# Altium schematic sheet 17_FLOW_Sensor.SchDoc
size 420 x 297 mm; SheetNumber: 27; SheetTotal: 36
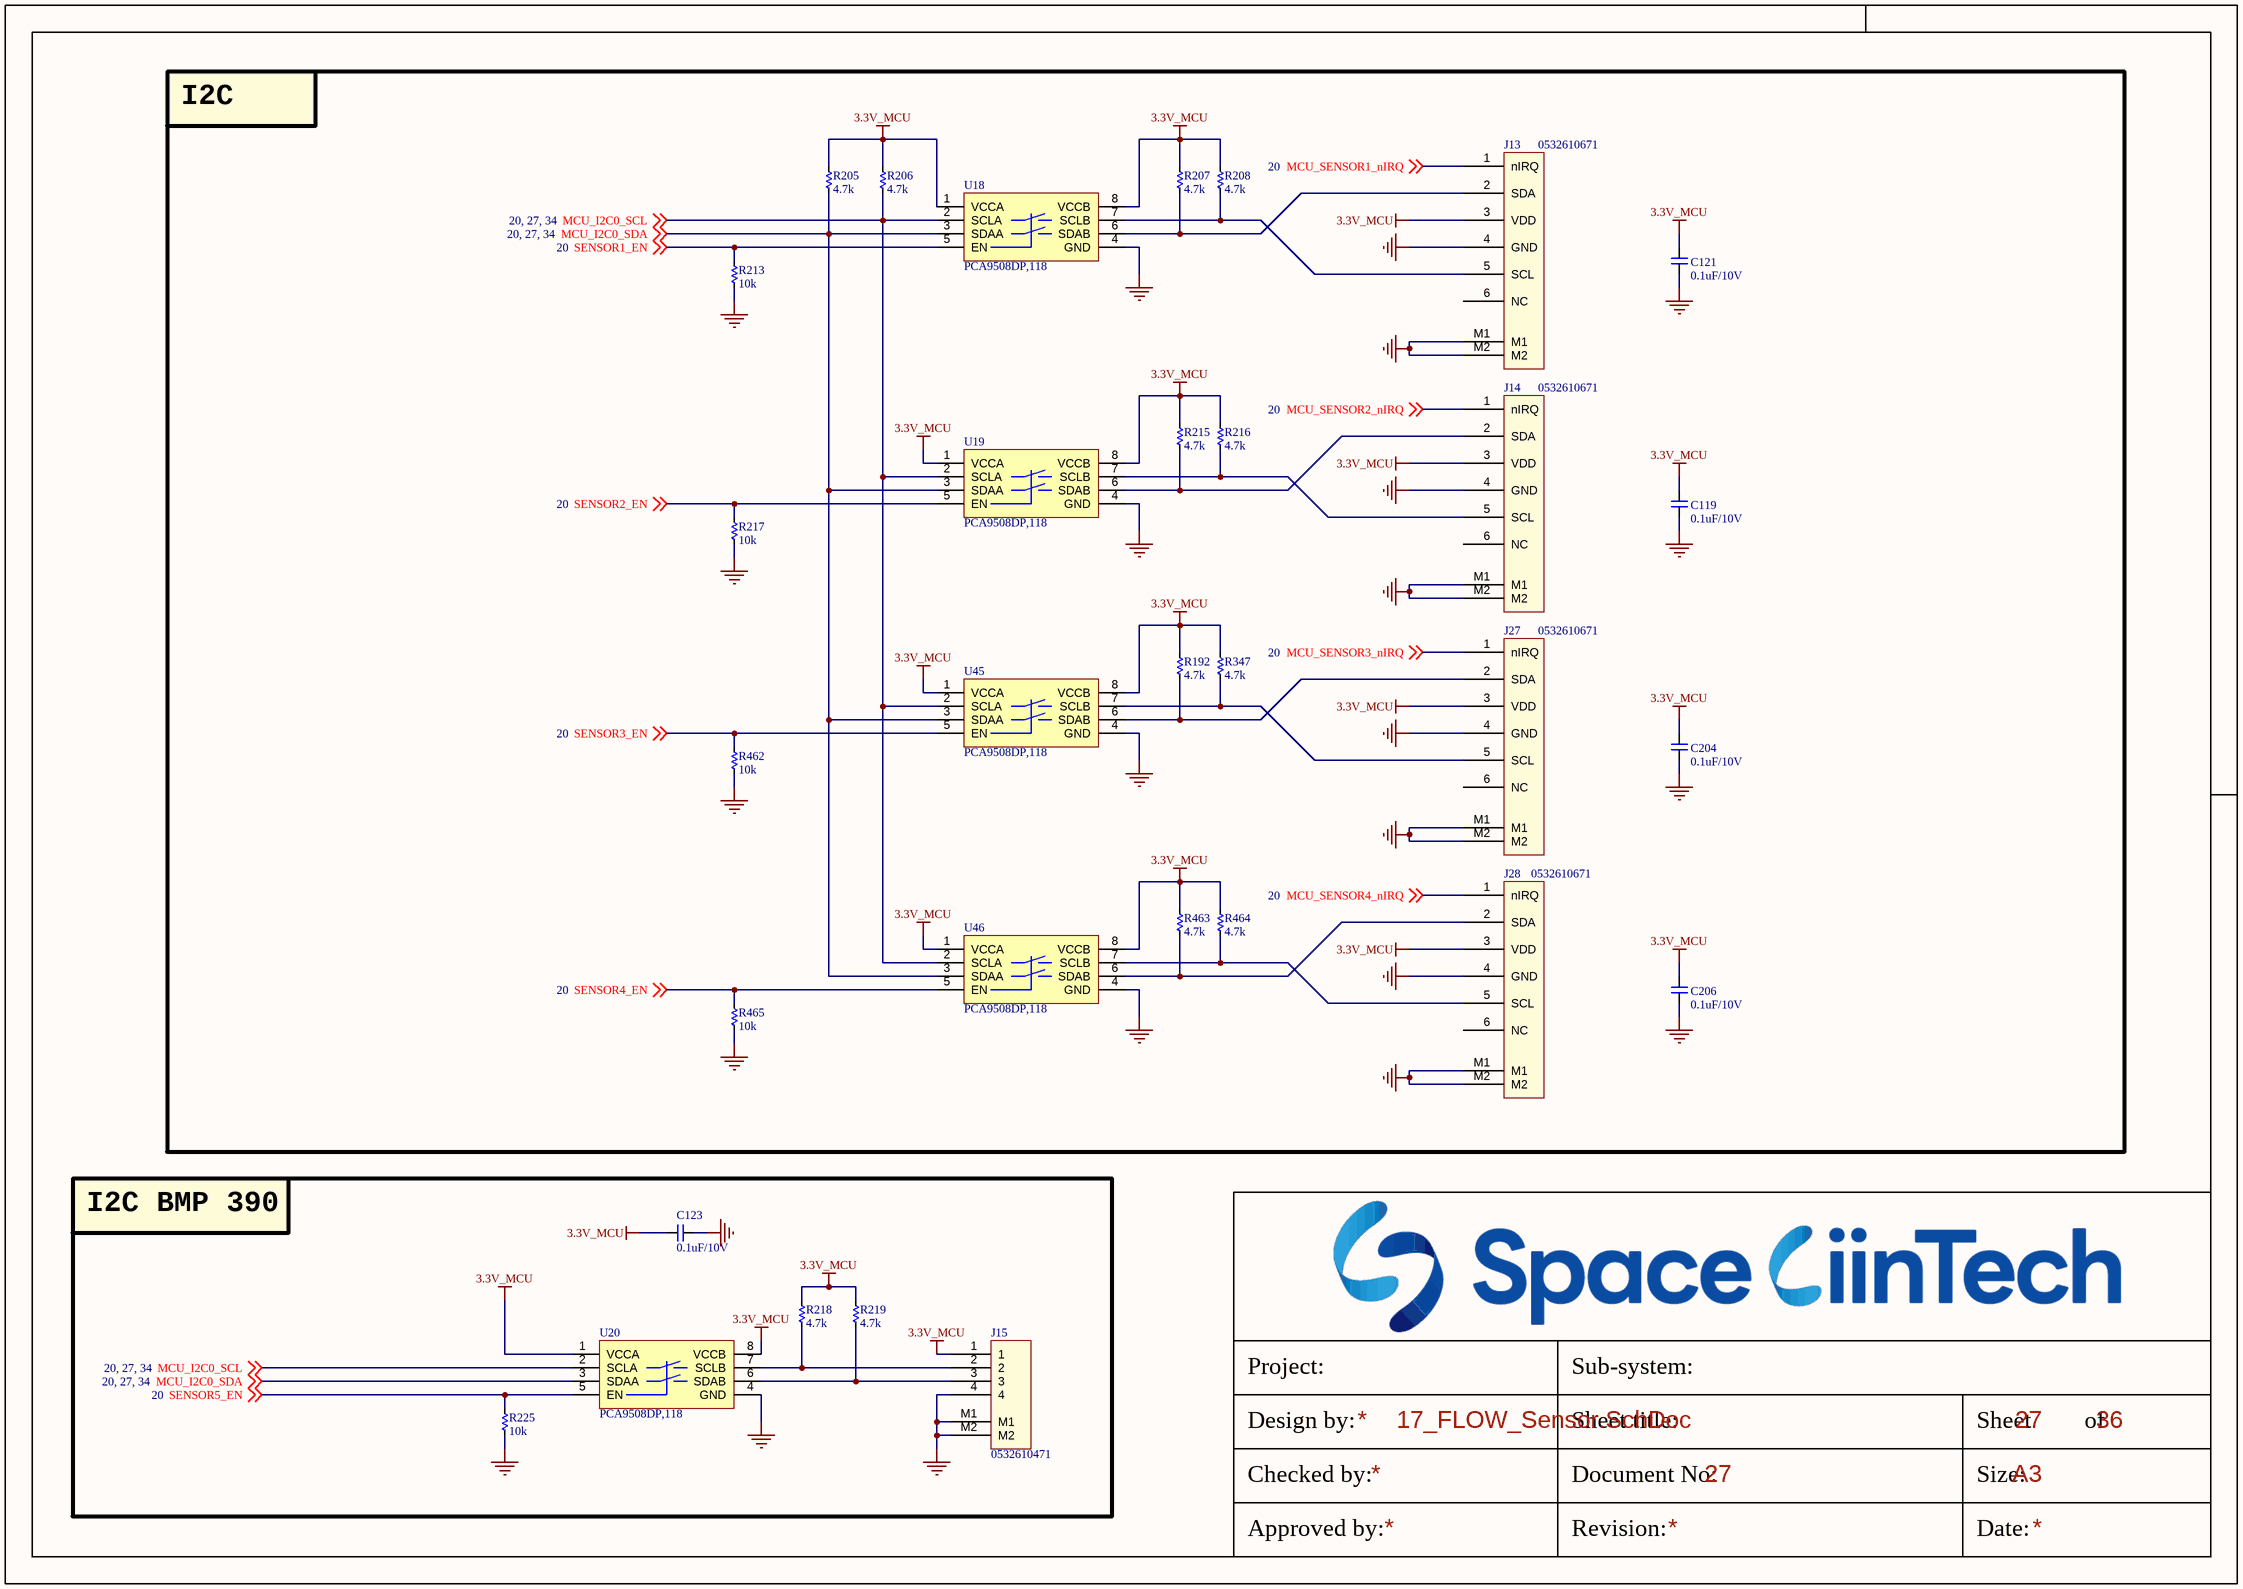
[diagram p0: 17_FLOW_Sensor.SchDoc]

## Parts
C119  0.1uF/10V  [CAP_C_1005X60]
C121  0.1uF/10V  [CAP_C_1005X60]
C123  0.1uF/10V  [CAP_C_1005X60]
C204  0.1uF/10V  [CAP_C_1005X60]
C206  0.1uF/10V  [CAP_C_1005X60]
J13  0532610671  [MOLEX_0532610671]
J14  0532610671  [MOLEX_0532610671]
J15  0532610471  [MOLEX_0532610471]
J27  0532610671  [MOLEX_0532610671]
J28  0532610671  [MOLEX_0532610671]
R192  4.7k  [RES_C_1005X40]
R205  4.7k  [RES_C_1005X40]
R206  4.7k  [RES_C_1005X40]
R207  4.7k  [RES_C_1005X40]
R208  4.7k  [RES_C_1005X40]
R213  10k  [RES_C_1005X40]
R215  4.7k  [RES_C_1005X40]
R216  4.7k  [RES_C_1005X40]
R217  10k  [RES_C_1005X40]
R218  4.7k  [RES_C_1005X40]
R219  4.7k  [RES_C_1005X40]
R225  10k  [RES_C_1005X40]
R347  4.7k  [RES_C_1005X40]
R462  10k  [RES_C_1005X40]
R463  4.7k  [RES_C_1005X40]
R464  4.7k  [RES_C_1005X40]
R465  10k  [RES_C_1005X40]
U18  PCA9508DP,118  [TSOP8]
U19  PCA9508DP,118  [TSOP8]
U20  PCA9508DP,118  [TSOP8]
U45  PCA9508DP,118  [TSOP8]
U46  PCA9508DP,118  [TSOP8]

## Blocks framed on the sheet
I2C: C119 C121 C204 C206 J13 J14 J27 J28 R192 R205-R208 R213 R215-R217 R347 R462-R465 U18 U19 U45 U46
I2C BMP 390: C123 J15 R218 R219 R225 U20

## Nets
3.3V_MCU: C119.2 C121.2 C123.2 C204.2 C206.2 J13.3(VDD) J14.3(VDD) J15.1 J27.3(VDD) J28.3(VDD) R192.1 R205.1 R206.1 R207.1 R208.1 R215.1 R216.1 R218.1 R219.1 R347.1 R463.1 R464.1 U18.1(VCCA) U18.8(VCCB) U19.1(VCCA) U19.8(VCCB) U20.1(VCCA) U20.8(VCCB) U45.1(VCCA) U45.8(VCCB) U46.1(VCCA) U46.8(VCCB)
GND: C119.1 C121.1 C123.1 C204.1 C206.1 J13.4(GND) J13.M1 J13.M2 J14.4(GND) J14.M1 J14.M2 J15.4 J15.M1 J15.M2 J27.4(GND) J27.M1 J27.M2 J28.4(GND) J28.M1 J28.M2 R213.2 R217.2 R225.2 R462.2 R465.2 U18.4(GND) U19.4(GND) U20.4(GND) U45.4(GND) U46.4(GND)
MCU_I2C0_SCL: R206.2 U18.2(SCLA) U19.2(SCLA) U20.2(SCLA) U45.2(SCLA) U46.2(SCLA) ; off-sheet MCU_I2C0_SCL
MCU_I2C0_SDA: R205.2 U18.3(SDAA) U19.3(SDAA) U20.3(SDAA) U45.3(SDAA) U46.3(SDAA) ; off-sheet MCU_I2C0_SDA
MCU_SENSOR1_nIRQ: J13.1(nIRQ) ; off-sheet MCU_SENSOR1_nIRQ
MCU_SENSOR2_nIRQ: J14.1(nIRQ) ; off-sheet MCU_SENSOR2_nIRQ
MCU_SENSOR3_nIRQ: J27.1(nIRQ) ; off-sheet MCU_SENSOR3_nIRQ
MCU_SENSOR4_nIRQ: J28.1(nIRQ) ; off-sheet MCU_SENSOR4_nIRQ
SENSOR1_EN: R213.1 U18.5(EN) ; off-sheet SENSOR1_EN
SENSOR2_EN: R217.1 U19.5(EN) ; off-sheet SENSOR2_EN
SENSOR3_EN: R462.1 U45.5(EN) ; off-sheet SENSOR3_EN
SENSOR4_EN: R465.1 U46.5(EN) ; off-sheet SENSOR4_EN
SENSOR5_EN: R225.1 U20.5(EN) ; off-sheet SENSOR5_EN
NetJ13_2: J13.2(SDA) R207.2 U18.6(SDAB)
NetJ13_5: J13.5(SCL) R208.2 U18.7(SCLB)
NetJ14_2: J14.2(SDA) R215.2 U19.6(SDAB)
NetJ14_5: J14.5(SCL) R216.2 U19.7(SCLB)
NetJ15_2: J15.2 R218.2 U20.7(SCLB)
NetJ15_3: J15.3 R219.2 U20.6(SDAB)
NetJ27_2: J27.2(SDA) R192.2 U45.6(SDAB)
NetJ27_5: J27.5(SCL) R347.2 U45.7(SCLB)
NetJ28_2: J28.2(SDA) R463.2 U46.6(SDAB)
NetJ28_5: J28.5(SCL) R464.2 U46.7(SCLB)

Not connected (* = marked no-connect by the designer): J13 6(NC); J14 6(NC); J27 6(NC); J28 6(NC)

## Notes on the sheet
- Project:
- Sub-system:
- Design by:
- Sheet title:
- Sheet
- of
- Checked by:
- Approved by:
- Revision:
- Document No:
- Size:
- Date:
- A3

## Library data of the parts
C119 C121 C123 C204 C206 = _CAP_C_2: CAP
J13 J14 J27 J28 = FLOW_SENSOR
J15 = Header 4x1_2M
R192 R205-R208 R213 R215-R219 R225 R347 R462-R465 = _RES_B_2: RES